# EAGLE board EEZ DIB DCP405 r1B1 (EAGLE 7.2.0), part 1 of 2
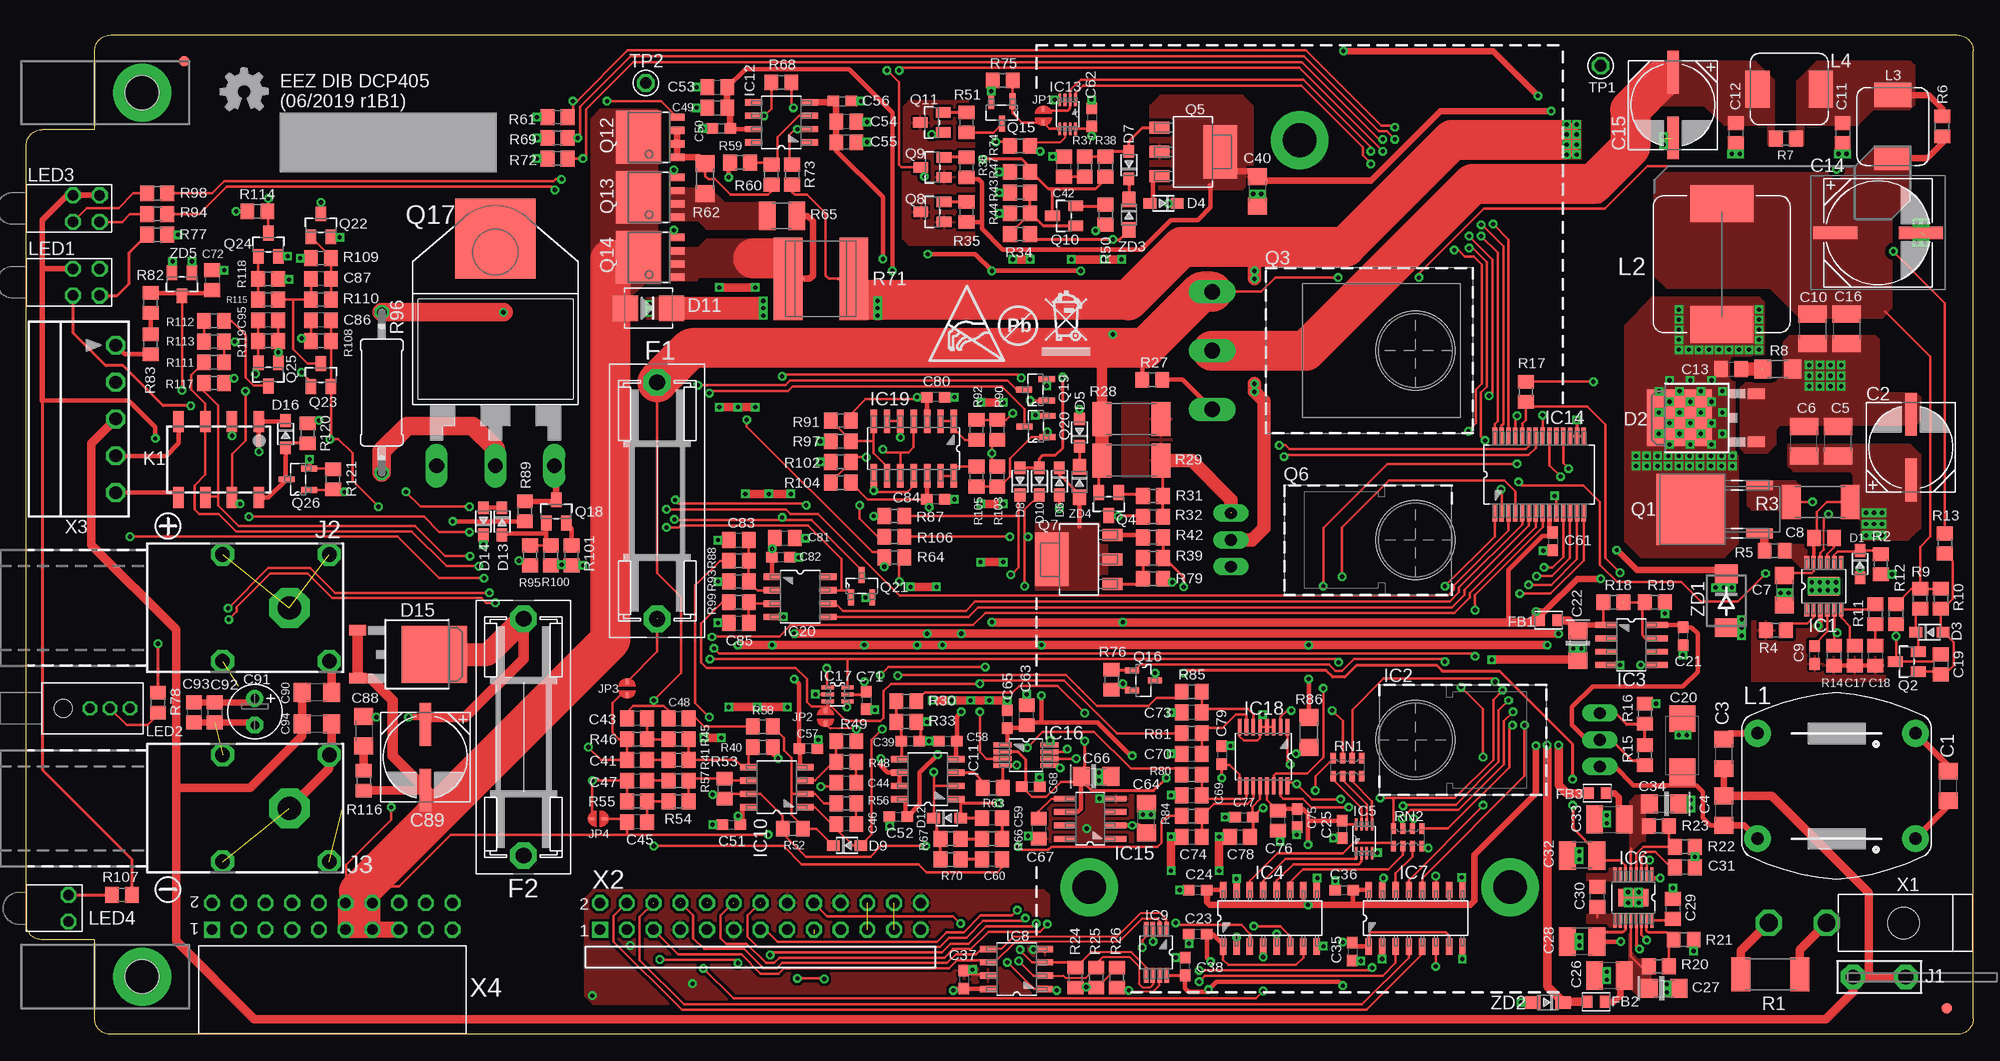
[diagram p6: board, top side]
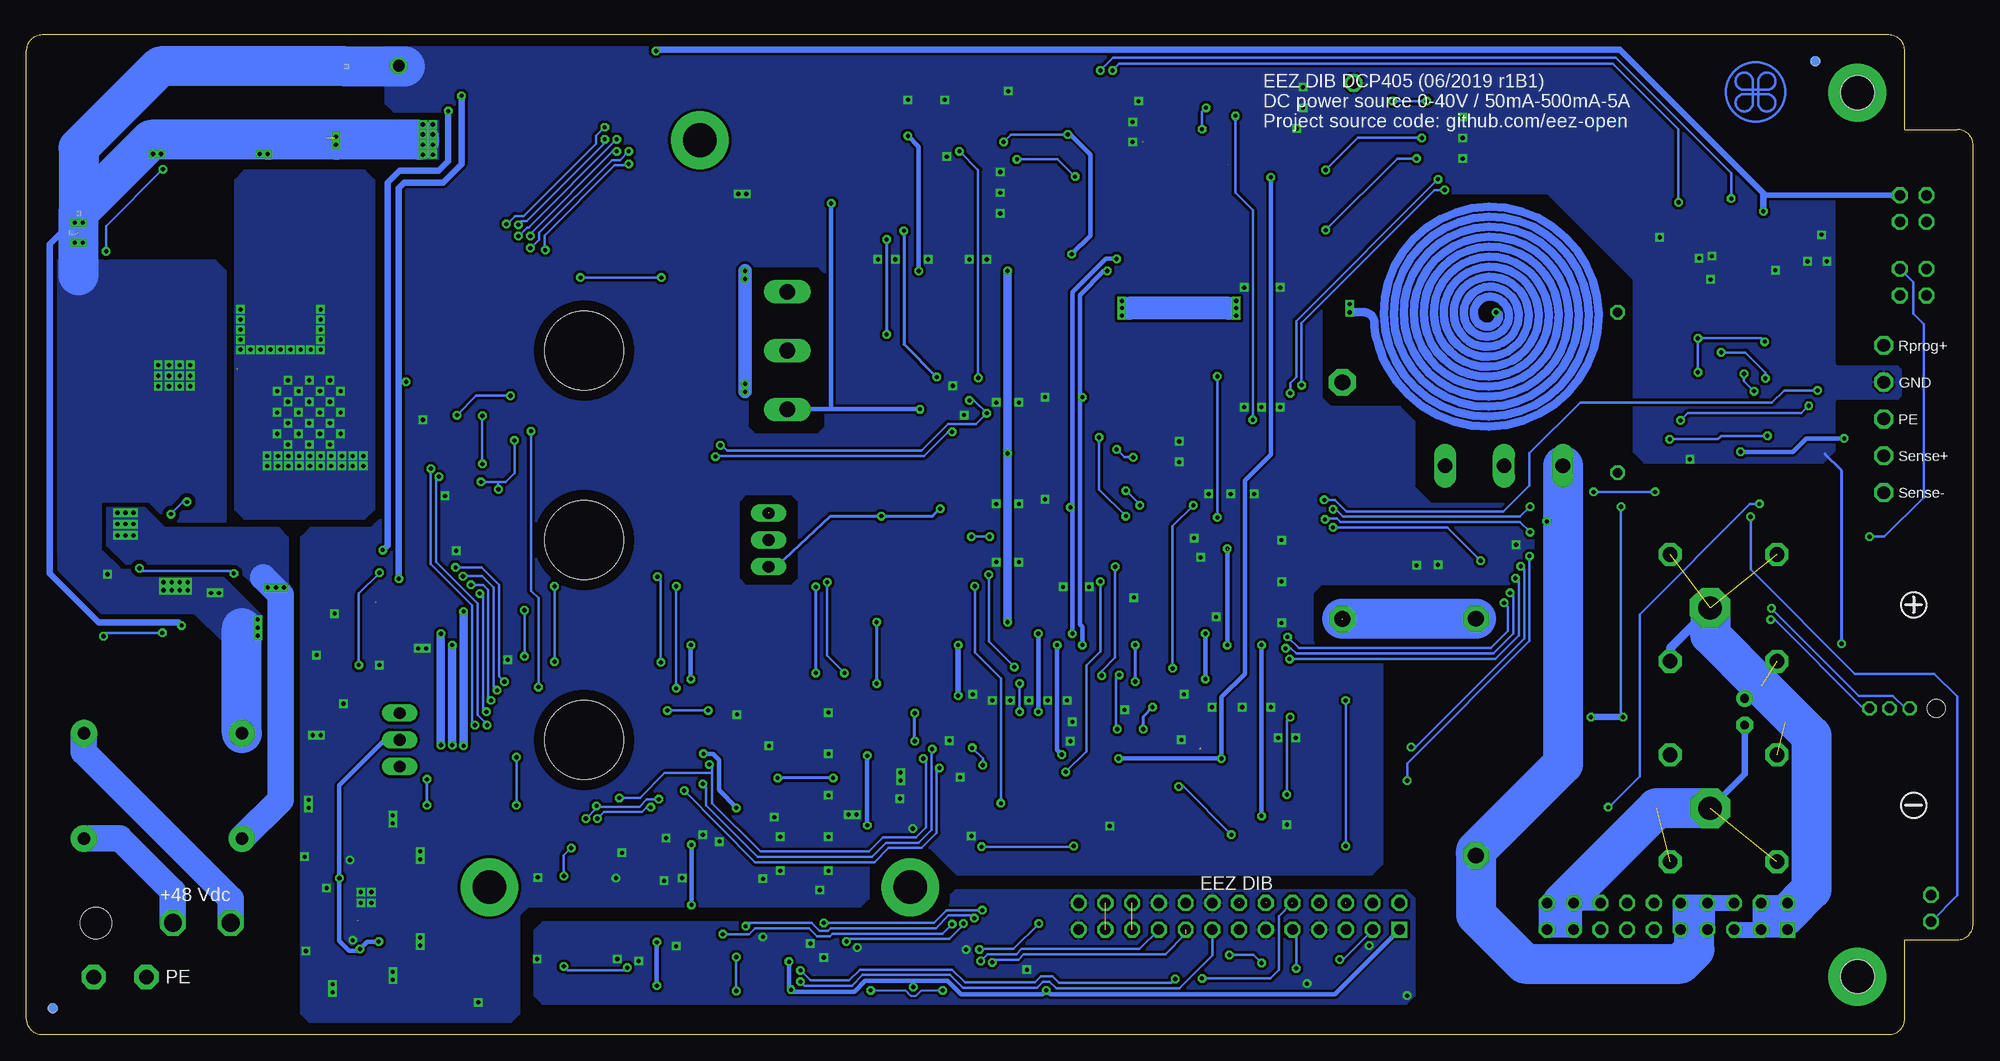
[diagram p7: board, bottom side, seen from below]

Size 185 x 95 mm. Coordinates in mm from the lower left corner, seen from the top.
Outline: 8,95 183.5,95 arc-90 185,93.5 185,1.5 arc-90 183.5,0 8,0 arc-90 6.5,1.5 6.5,9 1.5,9 arc-90 0,10.5 0,84.5 arc-90 1.5,86 6.5,86 6.5,93.5 arc-90 8,95
Copper layers (1*16): Top 0.035mm / dielectric 1.5mm / Bottom 0.035mm
Design rules "default *": minimum track width 6mil, minimum drill 0.3mm, track to track 6mil, track to pad 6mil, pad to pad 6mil, via to via 6mil, smd to smd 6mil, copper to edge 40mil, drill to drill 8mil, minimum pad ring 4mil, minimum via ring 8mil, stop-mask expansion 2.5mil, vias tented up to drill 1mm, thermal gap 8mil
Net classes: 0 default: width 0.203 mm, drill 0.3 mm, clearance 0.203 mm; 1 lvds: width 0.152 mm, drill 0.3 mm, clearance 0.152 mm to class 0, clearance 0.152 mm; 2 gnd: width 0.254 mm, drill 0.584 mm, clearance 0.254 mm
Holes 7.5 mm at 132,65 132,47 132,28
vRestrict: area 97.5,10.5 to 104.5,17.5; area 137.5,10.5 to 144.5,17.5; area 117.5,81.5 to 124.5,88.5

## Footprints (pad centres in the part's own frame; a part is rotated, then mirrored left to right if it is on the bottom)
C1206 = smd 1.6 x 1.8: 1 -1.4,0; 2 1.4,0
CAPAE830X1050N = smd 4.064 x 1.092: + -3.124,0; - 3.124,0
C1210 = smd 1.6 x 2.7: 1 -1.4,0; 2 1.4,0
C0805 = smd 1.3 x 1.5: 1 -0.95,0; 2 0.95,0
C0603 = smd 1.1 x 1: 1 -0.85,0; 2 0.85,0
CAPAE1030X1050N = smd 4.166 x 1.194: + -4.064,0; - 4.064,0
C/6032-28R = smd 2.55 x 2.5: + 2.525,0; - -2.525,0
EC1206 = smd 1.6 x 1.8: + -1.4,0; - 1.4,0
ECAP2/5 = drill 0.813 pad 1.6: + -1.27,0 | drill 0.813 pad 1.6 octagon: - 1.27,0
SOD323-R = smd 1.2 x 1: A 1.3,0; C -1.3,0
TO252-L = smd 1 x 1.6: 1 -2.28,-6.07; 2 2.28,-6.07 | smd 5.4 x 6.2: 3 0,1.23
SMB = smd 2.4 x 2.4: A 2.2,0; C -2.2,0
ZH32 = drill 1.5 pad 2.54 octagon: 1 -11.25,0; 2 11.25,0
BEAD0603 = smd 1 x 1.1: P$1 -0.85,0; P$2 0.85,0
FIDUCIAL_DUAL = smd 1.016 x 1.016 bottom: B 0,0 | smd 1.016 x 1.016: T 0,0
LTC_05-08-1666 = smd 1.27 x 0.457: 1 -2.235,1.63; 2 -2.235,0.98; 3 -2.235,0.33; 4 -2.235,-0.33; 5 -2.235,-0.98; 6 -2.235,-1.63; 7 2.235,-1.63; 8 2.235,-0.98; 9 2.235,-0.33; 10 2.235,0.33; 11 2.235,0.98; 12 2.235,1.63 | smd 1.753 x 2.946: TP 0,0
TO220H-CLR2 = drill 1.118 long: 1 -2.54,-17.526; 2 0,-17.526; 3 2.54,-17.526
SOIC127P600X175-8N = smd 1.981 x 0.559: 1 -2.464,1.905; 2 -2.464,0.635; 3 -2.464,-0.635; 4 -2.464,-1.905; 5 2.464,-1.905; 6 2.464,-0.635; 7 2.464,0.635; 8 2.464,1.905
SOIC-16 = smd 1.549 x 0.61: 1 -2.692,4.445; 2 -2.692,3.175; 3 -2.692,1.905; 4 -2.692,0.635; 5 -2.692,-0.635; 6 -2.692,-1.905; 7 -2.692,-3.175; 8 -2.692,-4.445; 9 2.692,-4.445; 10 2.692,-3.175; 11 2.692,-1.905; 12 2.692,-0.635; 13 2.692,0.635; 14 2.692,1.905; 15 2.692,3.175; 16 2.692,4.445
DCU8 = smd 1.168 x 0.254: 1 -1.372,0.75; 2 -1.372,0.25; 3 -1.372,-0.25; 4 -1.372,-0.75; 5 1.372,-0.75; 6 1.372,-0.25; 7 1.372,0.25; 8 1.372,0.75
SOP50P490X110-17N = smd 1.397 x 0.279: 1 -2.184,1.753; 2 -2.184,1.245; 3 -2.184,0.762; 4 -2.184,0.254; 5 -2.184,-0.254; 6 -2.184,-0.762; 7 -2.184,-1.245; 8 -2.184,-1.753; 9 2.184,-1.753; 10 2.184,-1.245; 11 2.184,-0.762; 12 2.184,-0.254; 13 2.184,0.254; 14 2.184,0.762; 15 2.184,1.245; 16 2.184,1.753 | smd 1.651 x 2.845: 17 0,0
SOIC127P600X173-8N = smd 1.55 x 0.6: 1 -2.7,1.9; 2 -2.7,0.63; 3 -2.7,-0.64; 4 -2.7,-1.91; 5 2.7,-1.91; 6 2.7,-0.64; 7 2.7,0.63; 8 2.7,1.9
DGK8 = smd 1.422 x 0.432: 1 -2.184,0.965; 2 -2.184,0.33; 3 -2.184,-0.33; 4 -2.184,-0.965; 5 2.184,-0.965; 6 2.184,-0.33; 7 2.184,0.33; 8 2.184,0.965
SOP65P780X200-28N = smd 1.651 x 0.432: 1 -3.632,4.216; 2 -3.632,3.581; 3 -3.632,2.921; 4 -3.632,2.286; 5 -3.632,1.626; 6 -3.632,0.965; 7 -3.632,0.33; 8 -3.632,-0.33; 9 -3.632,-0.965; 10 -3.632,-1.626; 11 -3.632,-2.286; 12 -3.632,-2.921; 13 -3.632,-3.581; 14 -3.632,-4.216; 15 3.632,-4.216; 16 3.632,-3.581; 17 3.632,-2.921; 18 3.632,-2.286; 19 3.632,-1.626; 20 3.632,-0.965; 21 3.632,-0.33; 22 3.632,0.33; 23 3.632,0.965; 24 3.632,1.626; 25 3.632,2.286; 26 3.632,2.921; 27 3.632,3.581; 28 3.632,4.216
DGK8-M = smd 1.727 x 0.483: 1 -2.235,0.965; 2 -2.235,0.33; 3 -2.235,-0.33; 4 -2.235,-0.965; 5 2.235,-0.965; 6 2.235,-0.33; 7 2.235,0.33; 8 2.235,0.965
SOT65P210X110-6N = smd 1.168 x 0.356: 1 -0.94,0.66; 2 -0.94,0; 3 -0.94,-0.66; 4 0.94,-0.66; 5 0.94,0; 6 0.94,0.66
PW(R-PDSO-G16) = smd 1.6 x 0.35: 1 -2.8,2.3; 2 -2.8,1.65; 3 -2.8,1; 4 -2.8,0.35; 5 -2.8,-0.3; 6 -2.8,-0.95; 7 -2.8,-1.6; 8 -2.8,-2.25; 9 2.8,-2.25; 10 2.8,-1.6; 11 2.8,-0.95; 12 2.8,-0.3; 13 2.8,0.35; 14 2.8,1; 15 2.8,1.65; 16 2.8,2.3
SOIC127P600X175-14N = smd 2.2 x 0.6: 1 -2.591,3.81; 2 -2.591,2.54; 3 -2.591,1.27; 4 -2.591,0; 5 -2.591,-1.27; 6 -2.591,-2.54; 7 -2.591,-3.81; 8 2.591,-3.81; 9 2.591,-2.54; 10 2.591,-1.27; 11 2.591,0; 12 2.591,1.27; 13 2.591,2.54; 14 2.591,3.81
PCB_TAB-4907 = drill 1.4 pad 2.3 octagon: 1 -2.5,0; 2 2.5,0
S16N-PC = drill 2.2 pad 3.81 octagon: 1 0,0 | drill 1.4 pad 2.184 octagon: NC1 -3.8,5.08; NC2 -3.8,-5.08; NC3 6.36,5.08; NC4 6.36,-5.08
JP2-CUT = smd 0.508 x 0.254: 1 -0.635,0; 2 0.635,0
G6K-2F = smd 1 x 2: 1 -3.81,-3.6; 2 -1.27,-3.6; 3 1.27,-3.6; 4 3.81,-3.6; 5 3.81,3.6; 6 1.27,3.6; 7 -1.27,3.6; 8 -3.81,3.6
PCB-MB = hole 3.2: 0,0
RN112 = drill 1.2 pad 2.54: 1 -7.5,5; 2 7.5,5; 3 -7.5,-5; 4 7.5,-5
125CDMCC/DS = smd 3.5 x 6: 1 -5.75,0; 2 5.75,0
COILCRAFT_HPI0630 = smd 2.3 x 3.5: 1 -3,0; 2 3,0
WP934MD = drill 1 octagon: BA -1.27,1.27; BC -1.27,-1.27; TA 1.27,1.27; TC 1.27,-1.27
L-42WUM-1EGWT = drill 0.9 octagon: CC 4.445,0; GREEN 6.35,0; RED 2.54,0 | hole 1.7: 0,0
WP934AD = drill 1 octagon: A 0,1.27; C 0,-1.27
TO229P990X239-3N = smd 0.94 x 2.489: 1 -2.286,-6.401; 3 2.286,-6.401 | smd 6.731 x 6.528: 2 0,0.152
SOT23-BEC = smd 1 x 1.4: B -0.95,-1.1; C 0,1.1; E 0.95,-1.1
TO247BH-CLR2 = drill 1.499 long: 1 -5.588,-19.304; 2 0,-19.304; 3 5.588,-19.304
SOT230P700X180-4N = smd 1.905 x 1.143: 1 -3.2,2.311; 2 -3.2,0; 3 -3.2,-2.311 | smd 3.175 x 5.08: 4 2.565,0
SOT669 = smd 0.7 x 1.4: 1 -1.905,-2.65; 2 -0.635,-2.65; 3 0.635,-2.65; 4 1.905,-2.65 | smd 5 x 4.3: MB 0,1
SOT103P240X110-3N = smd 1.524 x 0.559: 1 -1.079,1.016; 2 -1.079,-1.016; 3 1.079,0
SOT95P237X112-3N = smd 1.321 x 0.559: 1 -1.092,0.94; 2 -1.092,-0.94; 3 1.092,0
TOP3_TRIAC_NOHOLE = drill 1.397 long: A1 -5.588,-20.32; A2 0,-20.32; G 5.588,-20.32 | smd 7.62 x 7.62: NC 0,1.27
R2512 = smd 1.8 x 3.2: 1 -2.8,0; 2 2.8,0
R0805 = smd 1.3 x 1.5: 1 -0.95,0; 2 0.95,0
R1206 = smd 1.6 x 1.803: 1 -1.422,0; 2 1.422,0
R1210 = smd 1.6 x 2.7: 1 -1.4,0; 2 1.4,0
R_H2728 = smd 2.743 x 7.823: 1 -3.124,0; 2 3.124,0 | smd 0.508 x 0.254: 1S -1.841,0; 2S 1.841,0
0411/15 = drill 0.914 octagon: 1 -7.62,0; 2 7.62,0
CAY16 = smd 0.5 x 1: 1 -1.35,-0.85; 2 -0.45,-0.85; 3 0.45,-0.85; 4 1.35,-0.85; 5 1.35,0.85; 6 0.45,0.85; 7 -0.45,0.85; 8 -1.35,0.85
SHORT_NOHOLE = smd 0.5 x 0.25 bottom: 1 0,0.117; 2 0,-0.117
PCB_SHIELD_TAB = drill 1.1 octagon: 1 0,0
MINIFIT_39301020 = drill 1.7 octagon: 1 0,0; 2 0,5.5 | hole 3: 0,-7.3
M20-9701346 = drill 1 pad 1.5 square: 1 -30.48,-2.54 | drill 1 pad 1.5 octagon: 2 -30.48,0; 3 -27.94,-2.54; 4 -27.94,0; 5 -25.4,-2.54; 6 -25.4,0; 7 -22.86,-2.54; 8 -22.86,0; 9 -20.32,-2.54; 10 -20.32,0; 11 -17.78,-2.54; 12 -17.78,0; 13 -15.24,-2.54; 14 -15.24,0; 15 -12.7,-2.54; 16 -12.7,0; 17 -10.16,-2.54; 18 -10.16,0; 19 -7.62,-2.54; 20 -7.62,0; 21 -5.08,-2.54; 22 -5.08,0; 23 -2.54,-2.54; 24 -2.54,0; 25 0,-2.54; 26 0,0
MC1,5/5-G-3,5 = drill 1.2 octagon: 1 -7,0; 2 -3.5,0; 3 0,0; 4 3.5,0; 5 7,0
SSW-110-02-T-D-RA = drill 1 pad 1.5 square: 1 22.86,2.54 | drill 1 pad 1.5 octagon: 2 22.86,0; 3 20.32,2.54; 4 20.32,0; 5 17.78,2.54; 6 17.78,0; 7 15.24,2.54; 8 15.24,0; 9 12.7,2.54; 10 12.7,0; 11 10.16,2.54; 12 10.16,0; 13 7.62,2.54; 14 7.62,0; 15 5.08,2.54; 16 5.08,0; 17 2.54,2.54; 18 2.54,0; 19 0,2.54; 20 0,0
DO214AA = smd 1.8 x 2.2: A 2.55,0; C -2.55,0
SOD323-W = smd 1.5 x 1.2: A 1.45,0; C -1.45,0
SOT23 = smd 1 x 1.4: 1 -0.95,-1.1; 2 0.95,-1.1; 3 0,1.1

## Placement (x,y rotation side)
C1  4n7/100V  [C1206]  182.63,23.62 270 top
C2  HHXC630ARA220MHA0G  [CAPAE830X1050N]  179.07,55.82 90 top
C3  4n7/100V  [C1206]  161.29,26.67 270 top
C4  4n7/100V  [C1206]  161.29,21.27 270 top
C5  4u7/100V  [C1210]  172.15,56.39 90 top
C6  4u7/100V  [C1210]  168.91,56.39 90 top
C7  1u/100V  [C1206]  167.07,42.23 270 top
C8  470n  [C0805]  170.81,47.18 180 top
C9  100n  [C0603]  169.93,36.07 90 top
C10  10u  [C1210]  169.74,67.06 270 top
C11  1u  [C0805]  172.59,85.66 270 top
C12  n.c.  [C0805]  162.43,85.66 270 top
C13  470p  [C0805]  161.99,63.25 0 top
C14  EEEFK1J101P  [CAPAE1030X1050N]  175.96,76.2 0 top
C15  EEEFK1H470P  [CAPAE830X1050N]  156.46,88.33 270 top
C16  10u  [C1210]  172.97,67.06 270 top
C17  120p  [C0805]  173.74,36 270 top
C18  4n7  [C0805]  175.7,36 270 top
C19  470p  [C0805]  181.93,35.18 270 top
C20  1uF/50V Tant.  [C/6032-28R]  157.35,27.5 270 top
C21  100n  [C0603]  157.42,37.85 270 top
C22  4u7 tant.  [EC1206]  147.45,36.96 270 top
C23  100n  [C0603]  111.32,9.53 180 top
C24  100n  [C0603]  111.32,13.72 0 top
C25  100n  [C0603]  125.03,19.49 270 top
C26  10u  [C1210]  150.43,5.59 180 top
C27  10u tant.  [EC1206]  155.64,4.38 0 top
C28  10u  [C1210]  147.83,8.83 180 top
C29  10n  [C0805]  156.46,11.94 270 top
C30  1u  [C0805]  149.29,13.08 90 top
C31  10n  [C0805]  157.61,15.88 180 top
C32  10u  [C1210]  147.83,17.02 180 top
C33  10u  [C1210]  150.43,20.45 0 top
C34  10u tant.  [EC1206]  155.64,21.91 180 top
C35  100n  [C0603]  125.98,7.87 270 top
C36  100n  [C0603]  125.22,13.72 0 top
C37  100n  [C0603]  89.09,5.21 270 top
C38  100n  [C0603]  110.11,6.48 90 top
C39  100n  [C0603]  84.01,27.88 0 top
C40  1u/100V  [C1206]  116.97,80.14 270 top
C41  47p  [C0805]  58.04,26.1 0 top
C42  10n  [C0805]  98.62,82.49 90 top
C43  2n2  [C0805]  58.04,30.04 180 top
C44  2n2  [C0805]  77.91,23.94 0 top
C45  2n2  [C0805]  58.04,20.19 180 top
C46  220p  [C0805]  77.91,20 180 top
C47  47p  [C0805]  58.04,24.13 0 top
C48  2n2  [C0805]  61.98,30.04 0 top
C49  10n  [C0805]  65.66,88.07 0 top
C50  100n  [C0603]  66.04,86.11 180 top
C51  100n  [C0603]  66.99,19.94 0 top
C52  100n  [C0603]  82.87,20.7 0 top
C53  1u  [C0805]  65.66,90.04 0 top
C54  10n  [C0805]  77.91,86.74 180 top
C55  1u  [C0805]  77.91,84.79 180 top
C56  100n  [C0603]  77.53,88.71 0 top
C57  100n  [C0603]  74.3,27.18 180 top
C58  100n  [C0603]  87.57,27.88 0 top
C59  1n  [C0805]  91.76,20.57 180 top
C60  1n  [C0805]  91.76,16.64 180 top
C61  100n  [C0603]  145.03,46.86 270 top
C62  100n  [C0603]  101.24,87.15 270 top
C63  1u  [C0805]  95.06,30.35 90 top
C64  4u7  [C1206]  106.43,20.57 90 top
C65  100n  [C0603]  93.22,29.97 270 top
C66  4u7 tant.  [EC1206]  101.66,24.51 0 top
C67  1u  [C0805]  96.2,19.56 270 top
C68  100n  [C0603]  95.44,23.56 180 top
C69  3n3  [C0805]  110.74,22.73 0 top
C70  3n3  [C0805]  110.74,26.67 0 top
C71  100n  [C0603]  79.82,31.75 270 top
C72  10n  [C0805]  17.65,71.69 270 top
C73  3n3  [C0805]  110.74,30.61 180 top
C74  3n3  [C0805]  110.74,18.8 0 top
C75  100n  [C0603]  120.78,20.57 90 top
C76  1u  [C0805]  118.94,20.32 90 top
C77  100n  [C0603]  115.7,20.64 0 top
C78  1u  [C0805]  115.32,18.8 0 top
C79  100n  [C0603]  113.6,26.54 270 top
C80  100n  [C0603]  86.42,60.58 180 top
C81  1u  [C0805]  72.07,47.18 0 top
C82  100n  [C0603]  71.69,45.34 180 top
C83  1n  [C0805]  67.69,46.99 0 top
C84  100n  [C0603]  86.42,50.86 180 top
C85  1n  [C0805]  67.69,39.12 0 top
C86  10n  [C0805]  28,67.88 180 top
C87  2n2  [C0805]  28,71.82 180 top
C88  470n  [C1206]  32.07,28.83 270 top
C89  HHXC630ARA220MHA0G  [CAPAE830X1050N]  37.91,26.35 270 top
C90  10n/200V  [C1206]  27.62,32.51 180 top
C91  N.C.  [ECAP2/5]  21.72,30.67 270 top
C92  N.C.  [C0805]  17.91,30.61 270 top
C93  N.C.  [C0805]  15.94,30.61 270 top
C94  10n/200V  [C1206]  27.62,29.53 0 top
C95  10n  [C0805]  22.99,67.88 180 top
D1  BAS316  [SOD323-R]  174.24,44.7 270 top
D2  STPS15H100  [TO252-L]  158.31,58.61 90 top
D3  BAS316  [SOD323-R]  180.85,38.23 0 top
D4  BAS316  [SOD323-R]  108.08,78.99 180 top
D5  BAS316  [SOD323-R]  100.08,57.21 90 top
D6  BAS316  [SOD323-R]  98.17,52.58 270 top
D7  BAS316  [SOD323-R]  104.78,82.61 90 top
D8  BAS316  [SOD323-R]  94.42,52.58 90 top
D9  BAS316  [SOD323-R]  77.98,17.97 0 top
D10  BAS316  [SOD323-R]  96.27,52.58 90 top
D11  SK55  [SMB]  59.12,69.02 180 top
D12  BAS316  [SOD323-R]  87.5,20.57 0 top
D13  BAS316  [SOD323-R]  45.21,48.77 270 top
D14  BAS316  [SOD323-R]  43.43,48.77 90 top
D15  SK10100D1-DIO  [TO252-L]  37.56,36.13 270 top
D16  BAS316  [SOD323-R]  24.64,57.05 270 top
EEZ_SIGNATURE  SIGNATURESMALL  [SIGNATURE_5MM]  20.68,89.58 180 top
F1  ZH32  [ZH32]  59.94,50.74 270 top
F2  ZH32  [ZH32]  47.24,28.26 270 top
FB1  60R@100MHz  [BEAD0603]  144.65,39.37 180 top
FB2  60R@100MHz  [BEAD0603]  149.16,3.11 180 top
FB3  60R@100MHz  [BEAD0603]  149.29,22.92 180 top
FM1  FIDUCIAL_2  [FIDUCIAL_DUAL]  15,92.5 0 top
FM2  FIDUCIAL_2  [FIDUCIAL_DUAL]  182.5,2.5 0 top
IC1  LTC3864EMSE#PBF  [LTC_05-08-1666]  170.81,42.61 90 top
IC2  TL783CKCSE3  [TO220H-CLR2]  132,28 270 bottom
IC3  LP2951  [SOIC127P600X175-8N]  152.53,37.02 0 top
IC4  SI8641BB-B-IS1  [SOIC-16]  118.17,11.05 90 top
IC5  SN74LVC1G139DCUR  [DCU8]  127.13,18.61 90 top
IC6  LTC3260EMSE#PBF  [SOP50P490X110-17N]  152.72,13.02 270 top
IC7  SI8641BB-B-IS1  [SOIC-16]  132.02,11.05 90 top
IC8  M24C32-WMN6P  [SOIC127P600X173-8N]  94.11,6.22 180 top
IC9  TMP1075AIDGK  [DGK8]  107.38,7.81 270 top
IC10  OPA2196ID  [SOIC127P600X173-8N]  71.31,23.5 180 top
IC11  MC33272ADR2G  [SOIC127P600X173-8N]  85.66,24.26 180 top
IC12  LTC2050HVCS8#PBF  [SOIC127P600X173-8N]  71.75,86.68 180 top
IC13  74AUP1G74DC.125  [DCU8]  98.95,87.45 270 top
IC14  MCP23S17-E/SS  [SOP65P780X200-28N]  143.76,53.21 90 top
IC15  REF5025AIDR  [SOIC127P600X175-8N]  101.09,20.51 180 top
IC16  DAC8552IDGKR  [DGK8-M]  95,26.54 0 top
IC17  SN74LVC1G3157DCKR  [SOT65P210X110-6N]  77.09,32.32 0 top
IC18  ADS1120IPWR  [PW(R-PDSO-G16)]  117.54,26.42 270 top
IC19  LM339D  [SOIC127P600X175-14N]  84.33,55.69 270 top
IC20  MAX9141ESA  [SOIC127P600X173-8N]  73.53,41.59 0 top
J1  4907  [PCB_TAB-4907]  176.09,5.46 180 top
J2  FCR7350R  [S16N-PC]  25,40.55 180 top
J3  FCR7350B  [S16N-PC]  25,21.5 180 top
JP1  JP2-CUT  [JP2-CUT]  96.65,87.31 270 top
JP2  JP2-CUT  [JP2-CUT]  75.95,30.16 270 top
JP3  JP2-CUT  [JP2-CUT]  57.09,32.89 90 top
JP4  JP2-CUT  [JP2-CUT]  54.36,20.51 180 top
K1  G6K-2F-5DC  [G6K-2F]  18.29,54.64 180 top
KK1  PCB-MB-01  [PCB-MB]  11,89.5 0 top
KK2  PCB-MB-01  [PCB-MB]  11,5.5 0 top
L1  RN112-4-02-0M7  [RN112]  172.02,23.62 180 top
L2  125CDMCCDS-330MC  [125CDMCC/DS]  161.1,73.22 90 top
L3  VLS6045AF-3R3N  [COILCRAFT_HPI0630]  177.36,86.3 90 top
L4  VLS6045AF-3R3N  [COILCRAFT_HPI0630]  167.51,89.85 180 top
LED1  WP934MD/2LID  [WP934MD]  5.7,71.5 0 top
LED2  WP42WUM/EGW  [L-42WUM-1EGWT]  3.5,31 0 top
LED3  WP934MD/LYLID  [WP934MD]  5.7,78.5 0 top
LED4  WP934AD/YD  [WP934AD]  4,12 0 top
Q1  SUD19P06-60  [TO229P990X239-3N]  158.31,49.91 90 top
Q2  MMBT5401  [SOT23-BEC]  178.69,35.43 90 top
Q3  IRFP250MPBF  [TO247BH-CLR2]  132,65 90 bottom
Q4  BC856C  [SOT23-BEC]  102.87,50.42 180 top
Q5  BCP56-16.115  [SOT230P700X180-4N]  110.87,83.88 0 top
Q6  STF10P6F6  [TO220H-CLR2]  132,47 90 bottom
Q7  BCP56-16.115  [SOT230P700X180-4N]  100.01,45.15 180 top
Q8  MMBT5401  [SOT23-BEC]  86.11,78.17 90 top
Q9  MMBT5401  [SOT23-BEC]  86.11,82.42 90 top
Q10  MMBT5551  [SOT23-BEC]  98.62,77.79 90 top
Q11  MMBT5551  [SOT23-BEC]  86.04,86.68 90 top
Q12  PSMN0R9-25YLC  [SOT669]  59.18,85.28 90 top
Q13  PSMN0R9-25YLC  [SOT669]  59.18,79.57 90 top
Q14  PSMN0R9-25YLC  [SOT669]  59.18,73.85 90 top
Q15  2N7002  [SOT103P240X110-3N]  92.71,87.63 270 top
Q16  BSS84P  [SOT95P237X112-3N]  106.17,33.66 0 top
Q17  BTA26-600  [TOP3_TRIAC_NOHOLE]  44.58,74.36 0 top
Q18  FMMT493TA  [SOT23-BEC]  50.36,49.72 0 top
Q19  2N7002  [SOT103P240X110-3N]  95.89,61.28 180 top
Q20  2N7002  [SOT103P240X110-3N]  95.95,57.78 180 top
Q21  2N7002  [SOT103P240X110-3N]  79.38,42.61 90 top
Q22  MMBT5551  [SOT23-BEC]  28,76.9 0 top
Q23  MMBT5401  [SOT23-BEC]  28,62.67 0 top
Q24  MMBT5551  [SOT23-BEC]  22.99,75.06 0 top
Q25  MMBT5551  [SOT23-BEC]  22.99,62.74 180 top
Q26  2N7002  [SOT103P240X110-3N]  25.81,52.77 180 top
R1  4K7/2W  [R2512]  165.74,5.71 0 top
R2  10K  [R0805]  176.21,44.7 90 top
R3  R010/2W  [R2512]  170.5,50.61 180 top
R4  47K  [R0805]  166.24,38.42 180 top
R5  1R  [R0805]  166.12,45.97 180 top
R6  100R  [R0805]  182.05,86.3 90 top
R7  100R  [R0805]  167.2,85.15 180 top
R8  10R  [R1206]  166.43,63.25 180 top
R9  10K  [R0805]  179.96,41.4 270 top
R10  100K  [R0805]  181.93,41.4 270 top
R11  10K  [R0805]  175.7,39.94 90 top
R12  316K  [R0805]  177.67,39.94 270 top
R13  100K  [R0805]  182.31,46.67 90 top
R14  4K7  [R0805]  171.77,36 270 top
R15  220R  [R0805]  153.8,26.54 90 top
R16  1K8  [R0805]  153.8,30.48 90 top
R17  10K  [R0805]  142.49,61.09 270 top
R18  16K  [R0805]  150.81,41.08 0 top
R19  5K1  [R0805]  154.75,41.08 0 top
R20  316K  [R0805]  155.13,6.48 0 top
R21  100K  [R0805]  157.48,9.02 0 top
R22  100K  [R0805]  157.61,17.84 180 top
R23  316K  [R0805]  155.13,19.81 180 top
R24  10K  [R0805]  99.69,5.4 90 top
R25  10K  [R0805]  101.66,5.4 90 top
R26  10K  [R0805]  103.63,5.4 270 top
R27  1K  [R0805]  107,62.23 180 top
R28  3R9/2W  [R2512]  105.03,58.49 180 top
R29  3R9/2W  [R2512]  105.03,54.55 180 top
R30  10K  [R0805]  83.63,31.69 180 top
R31  2K2  [R0805]  107.06,51.18 180 top
R32  2K2  [R0805]  107.06,49.21 180 top
R33  220R  [R0805]  83.63,29.72 0 top
R34  16K  [R0805]  94.42,76.07 0 top
R35  220R  [R0805]  89.34,78.17 270 top
R36  220R  [R0805]  89.34,82.42 270 top
R37  470R  [R0805]  100.58,82.49 90 top
R38  100R  [R0805]  102.55,82.49 270 top
R39  1K  [R0805]  107.06,45.28 0 top
R40  7K5 0.1%  [R0805]  69.98,27.3 180 top
R41  10K  [R0805]  61.98,26.1 0 top
R42  220R  [R0805]  107.06,47.24 0 top
R43  2K2  [R0805]  94.42,80.01 0 top
R44  750R  [R0805]  94.42,78.04 0 top
R45  100K 0.1%  [R0805]  61.98,28.07 180 top
R46  24K 0.1%  [R0805]  58.04,28.07 180 top
R47  51K  [R0805]  94.42,81.98 0 top
R48  220R  [R0805]  77.91,25.91 180 top
R49  10K  [R0805]  77.91,27.88 180 top
R50  470R  [R0805]  102.55,77.91 90 top
R51  1K8  [R0805]  89.34,86.68 90 top
R52  10K  [R0805]  72.83,19.56 0 top
R53  7K5 0.1%  [R0805]  66.36,23.37 90 top
R54  100K 0.1%  [R0805]  61.98,22.16 180 top
R55  24K 0.1%  [R0805]  58.04,22.16 180 top
R56  0R  [R0805]  77.91,21.97 0 top
R57  10K  [R0805]  61.98,24.13 0 top
R58  220R  [R0805]  69.98,29.27 0 top
R59  3K9 0.1%  [R0805]  67.82,82.87 0 top
R60  82R 0.1%  [R0805]  70.8,81.72 90 top
R61  47K  [R0805]  50.48,87.19 0 top
R62  0R75  [R1206]  64.52,81.34 270 top
R63  2K2  [R0805]  91.82,23.43 180 top
R64  10K  [R0805]  82.49,45.34 0 top
R65  0R082  [R1210]  71.82,77.79 180 top
R66  1K  [R0805]  91.76,18.61 180 top
R67  10K  [R0805]  87.82,18.61 180 top
R68  3K9 0.1%  [R0805]  71.75,90.49 180 top
R69  47K  [R0805]  50.48,85.22 0 top
R70  10K  [R0805]  87.82,16.64 180 top
R71  0R010 (low TCR)  [R_H2728]  75.5,71.82 180 top
R72  47K  [R0805]  50.48,83.25 0 top
R73  82R 0.1%  [R0805]  72.77,81.72 90 top
R74  10K  [R0805]  94.42,84.45 0 top
R75  100K  [R0805]  92.77,90.68 0 top
R76  100K  [R0805]  103.12,33.72 90 top
R77  470R  [R0805]  12.45,76.01 180 top
R78  270R  [R0805]  12.51,31.53 90 top
R79  10K  [R0805]  107.06,43.31 0 top
R80  220R  [R0805]  110.74,24.7 0 top
R81  220R  [R0805]  110.74,28.64 0 top
R82  470R  [R0805]  11.81,69.53 270 top
R83  470R  [R0805]  11.81,65.6 270 top
R84  220R  [R0805]  110.74,20.76 0 top
R85  220R  [R0805]  110.74,32.58 0 top
R86  10R  [R1206]  121.86,28.7 270 top
R87  10K  [R0805]  82.49,49.28 180 top
R88  750R  [R0805]  67.69,45.02 0 top
R89  470R  [R0805]  47.37,49.72 270 top
R90  5K1  [R0805]  92.27,57.47 270 top
R91  47K  [R0805]  77.41,58.36 0 top
R92  5K6  [R0805]  90.3,57.47 90 top
R93  10K  [R0805]  67.69,43.05 180 top
R94  330R  [R0805]  12.45,77.98 0 top
R95  1K  [R0805]  47.88,45.53 270 top
R96  AC01000001007JA100  [0411/15]  33.78,61.02 270 top
R97  2K2  [R0805]  77.41,56.39 0 top
R98  330R  [R0805]  12.45,79.95 180 top
R99  10K  [R0805]  67.69,41.08 0 top
R100  100K  [R0805]  49.85,45.53 90 top
R101  6R2  [R0805]  51.82,45.53 90 top
R102  10K  [R0805]  77.41,54.42 180 top
R103  5K1  [R0805]  92.27,53.02 90 top
R104  10K  [R0805]  77.41,52.45 180 top
R105  5K6  [R0805]  90.3,53.02 270 top
R106  10K  [R0805]  82.49,47.31 180 top
R107  470R  [R0805]  9.08,13.27 180 top
R108  330R  [R0805]  28,65.91 0 top
R109  47K  [R0805]  28,73.79 0 top
R110  47K  [R0805]  28,69.85 0 top
R111  750R  [R0805]  17.84,63.88 0 top
R112  1K  [R0805]  17.84,67.82 180 top
R113  2K2  [R0805]  17.84,65.85 0 top
R114  10K  [R0805]  21.97,78.23 180 top
R115  10K  [R0805]  22.99,69.85 0 top
R116  1R  [R0805]  32.07,24.13 90 top
R117  750R  [R0805]  17.84,61.91 180 top
R118  47K  [R0805]  22.99,71.82 180 top
R119  330R  [R0805]  22.99,65.91 0 top
R120  470R  [R0805]  26.73,57.15 90 top
R121  100K  [R0805]  29.15,52.77 270 top
RN1  DR1206-33R-4/8  [CAY16]  125.54,25.4 0 top
RN2  DR1206-33R-4/8  [CAY16]  131.25,18.73 0 top
SH1  [SHORT_NOHOLE]  154.56,92.01 270 top
SH2  Pgnd to Pout- short  [SHORT_NOHOLE]  180.02,78.04 0 top
SH3  Sgnd to Pgnd short  [SHORT_NOHOLE]  180.72,76.2 270 top
TP1  [PCB_SHIELD_TAB]  149.61,92.08 0 top
TP2  [PCB_SHIELD_TAB]  58.86,90.42 0 top
U$1  [RECYCLE_BIN1/8]  96.52,64.52 0 top
U$6  [ESD_SYMBOL]  85.81,64.03 0 top
U$7  [PB_SMALL]  94.24,67.37 0 top
X1  39-30-1020  [MINIFIT_39301020]  171.07,10.6 90 top
X2  M20-9701346  [M20-9701346]  85,12.5 0 top
X3  1844249  [MC1,5/5-G-3,5]  8.5,58.5 270 top
X4  ZL263-20DG  [SSW-110-02-T-D-RA]  40.5,12.5 180 top
ZD1  SMAJ51A  [DO214AA]  161.54,41.21 270 top
ZD2  PDZ5.6B  [SOD323-W]  144.59,3.05 180 top
ZD3  BZX384-C13  [SOD323-W]  104.78,77.91 270 top
ZD4  PDZ6.2B  [SOD323-W]  100.08,52.51 270 top
ZD5  SLVU2.8-TP  [SOT23]  14.8,71.31 180 top

## Tracks (layer width: path | path; a pad name or v marks a point on that pad's centre or on a via)
5A_S
  Top 0.254: 71.82,73.79 71.82,72.38 R71.2
  Top 3.81: 69.07,73.79 71.82,73.79
  pour Top (isolate 0.305, no thermals): 61.21,71.69 63.69,71.69 64.01,72.01 69.72,72.01 69.72,75.56 64.64,75.56 63.82,74.74 61.21,74.74
50MA_S
  Top 0.254: R60.1 70.8,80.14 70.48,79.82 66.93,79.82 65.47,81.28 64.83,81.28 64.52,81.6 R62.1
  Top 0.61: Q12.3 Q12.2 Q12.1 63.91,83.38 R62.1
500MA_S
  Top 1.27: 70.36,77.85 R65.2
  pour Top (isolate 0.305, no thermals): 61.21,80.39 64.96,80.39 66.36,78.99 70.36,78.99 70.36,76.58 64.64,76.58 63.82,77.41 61.21,77.41
!ADC_DRDY  (via drill 0.4)
  Top 0.254: IC14.25 141.48,58.61 v141.67,58.8 | IC18.14 118.54,24.62 118.75,24.83 121.73,24.83 123.25,26.35 v123.25,32.89 | v123.25,42.61 123.25,48.13 129.35,54.23 v141.67,54.23
  Bottom 0.254: v141.67,58.8 v141.67,54.23 | v123.25,32.89 v123.25,42.61
!DP_DRIVE
  Top 0.305: 105.66,44.83 R39.1 R79.1 105.64,42.84 Q7.1
  Top 0.406: 105.75,43.22 R79.1
!OVP_FAULT  (via drill 0.4)
  Top 0.203: IC13.6 98.7,85.23 98.23,84.77 95.69,84.77 R74.2
  Top 0.254: Q21.3 79.38,44.13 74.61,48.9 72.07,48.9 v71.82,49.15 71.56,48.9 61.66,48.9 v61.59,48.96 | v71.82,62.55 71.88,62.55 72.07,62.74 94.23,62.74 v94.55,62.42 | v21.14,49.21 37.78,49.21 39.24,47.75 v42.1,47.75 | v96.33,83.95 95.88,83.95 R74.2
  Bottom 0.254: v61.59,48.96 61.53,49.02 60.45,49.02 60.13,48.7 43.05,48.7 v42.1,47.75 | v71.82,49.15 v71.82,62.55 | v94.55,62.42 94.55,82.17 v96.33,83.95 | v21.14,49.21 21.14,44.2 11.24,34.29 3.68,34.29 1.52,32.13 1.52,13.21 LED4.C
!OVP_LE
  Top 0.254: IC20.5 89.53,39.68 90.42,40.58 135.45,40.58 136.65,41.78 136.65,42.23 142.8,48.37 IC14.6
!RESET  (via drill 0.4)
  Top 0.254: IC14.18 146.05,54.29 v146.56,53.78 | IC7.12 132.65,14.86 142.37,24.57 v142.37,29.4
  Bottom 0.254: v146.56,53.78 146.56,44.7 142.62,40.77 142.62,29.65 v142.37,29.4 142.56,29.59
!SET_DP  (via drill 0.4)
  Top 0.254: IC14.1 139.55,47.35 v134.81,42.61 | 103.3,34.85 R76.2 | Q16.1 105.52,34.85 105.86,35.18 123.76,35.18 124.4,34.54 125.03,34.54 126.17,35.69 134.56,35.69 v134.81,35.43
  Top 0.305: Q16.1 103.2,34.59 R76.2
  Bottom 0.254: v134.81,42.61 v134.81,35.43
+3V3  (via drill 0.4)  (1 unrouted)
  Top 0.203: R25.1 101.73,4.45 R26.1
  Top 0.254: IC7.7 135.19,9.4 134.87,9.72 127.83,9.72 127.57,9.46 IC7.1 | 113.73,8.89 IC4.1 113.73,7.11 114.24,6.6 120.65,6.6 121.35,7.3 IC4.7 | R24.1 100.52,4.45 v100.71,4.51 100.9,4.45 R25.1
  Top 0.305: IC9.8 C38.1
  Top 0.406: IC7.1 126.03,8.36 C35.1 v125.09,8.76 | C37.2 89.13,4.6 | IC8.8 89.44,4.32 C37.2 | C23.1 112.33,9.53 | 113.73,8.89 113.67,8.83 113.47,8.83 112.78,9.53 C23.1 | C37.2 88.24,4.36 v88.08,4.19 | 112.2,9.36 C23.1 | v125.09,4.64 124.71,5.02 113.09,5.02 v112.33,4.25 112.14,4.06 110.43,4.06 110.11,4.38 C38.1 | C23.1 112.17,7.28 v112.52,6.92
  Bottom 0.254: v100.71,4.51 100.71,5.08
  Bottom 0.406: v125.09,4.64 v125.09,8.76 | v112.52,6.92 112.52,4.45 v112.33,4.25 112.14,4.06 106.3,4.06 105.28,5.08 100.71,5.08 97.47,5.08 96.2,3.81 88.46,3.81 v88.08,4.19 87.69,3.81 60.67,3.81 X2.1
+5V  (via drill 0.4)
  Top 0.254: C62.2 100.96,86.08 IC13.8 IC13.7 | IC7.10 135.19,12.38 135.25,12.32 | IC4.10 121.35,12.38 v121.79,12.32 | IC18.13 117.89,22.32 C76.2 | IC5.8 125.4,19.98 C25.1 | R90.2 91.76,56.01 v91.76,55.24 91.76,54.48 R103.2 | R17.1 146.3,62.04 v148.91,62.04 | v92.14,84.84 93.09,84.84 R74.1 | R114.2 v19.94,78.23
  Top 0.305: R114.2 21.02,77.85 | 1.52,60.26 1.52,25.15 10.03,16.64 R107.1 | 101.22,86.27 v101.22,85.41 | 103.25,32.64 R76.1 103.33,32.97 104.14,32.97 | v104.2,33.34 104.2,33.03 104.14,32.97 | 104.14,32.97 104.83,32.97 Q16.2
  Top 0.406: D16.C 24.52,58.24 K1.1 v22.1,55.37 | v12.26,56.64 12.26,57.72 9.72,60.26 1.52,60.26 | IC7.16 126.1,13.74 C36.2 126.07,12.41 125.98,12.32 | IC4.16 112.19,13.74 C24.2 | 101.25,86.36 C62.2 101.22,86.27 | C76.2 119.09,21.42 C75.2 121.32,21.42 121.79,20.95 121.79,20.32 | IC14.9 144.73,47.66 C61.1 144.69,47.37 144.08,47.37 140.84,44.13 140.84,39.24 140.91,39.18 | v100.2,72.58 v91.76,72.58 90.17,74.17 v85.66,74.17 | Q11.B 86.95,85.53 v86.04,85.53 | v121.79,18.03 121.79,20.32 | C25.1 125.01,20.32 121.79,20.32
  Top 0.508: 1.52,72.71 1.52,60.26 | 1.52,72.71 1.52,77.41 3.89,79.77 LED3.BA LED3.TA | LED1.BA 1.59,72.77 1.52,72.71
  Top 0.61: C24.2 112.17,12.61 112.46,12.32 v121.79,12.32 125.98,12.32 135.25,12.32 137.22,12.32 137.6,12.7 137.6,17.08 143.45,22.92 v143.45,27.43 | v149.61,43.31 147.38,43.31 144.27,40.2 v143.45,40.2 | v125.16,93.47 139.38,93.47 v143.64,89.22
  Top 0.813: v143.45,40.2 143.45,39.73 FB1.P$2 143.61,39.18 140.91,39.18 v104.2,39.18 v91.76,39.18
  Bottom 0.254: v148.91,62.04 149.61,62.04 | v86.04,85.53 91.44,85.53 v92.14,84.84
  Bottom 0.305: v104.2,39.18 v104.2,33.34
  Bottom 0.406: v22.1,55.37 17.14,55.37 15.88,56.64 v12.26,56.64 | v86.04,85.53 85.79,85.53 83.88,83.63 83.88,75.95 v85.66,74.17 | v121.79,18.03 v121.79,12.32 | v100.2,72.58 100.2,84.39 v101.22,85.41
  Bottom 0.508: LED3.TA 19.76,79.77 19.94,79.95
  Bottom 0.61: v143.64,89.22 143.64,82.74 145.41,80.96 149.1,80.96 149.61,80.45 149.61,62.04 v149.61,43.31 | v125.16,93.47 125.03,93.6 33.59,93.6 19.94,79.95 v19.94,78.23
  Bottom 0.813: v91.76,39.18 v91.76,55.24 v91.76,72.58 | v143.45,40.2 v143.45,27.43
+5VOUT
  Top 0.254: R20.1 153.42,6.48 152.46,7.43 IC6.12
  Top 0.61: FB2.P$1 150.88,3.11 151.45,3.68 151.45,5.2 C26.1
  pour Top (isolate 0.305, no thermals): 154.31,3.62 154.31,7.11 153.16,7.11 152.59,7.68 152.59,11.37 152.34,11.37 152.34,4.51 153.23,3.62
+VNR  (via drill 0.4)
  Top 0.254: IC6.1 154.47,14.88 154.5,14.86 154.56,14.86 | 149.22,9.78 C28.1
  Top 0.305: IC6.11 151.96,9.97 151.7,9.72 149.29,9.72 149.22,9.78 | IC6.13 152.97,8.45 v153.29,8.13 | IC2.2 150.62,28 152.58,26.04 153.35,26.04 R15.1
  Top 0.406: v151.51,8.83 C28.1 | v155.26,14.86 154.56,14.86 | IC3.8 157.19,38.92 C21.1 158.22,38.7 158.81,38.1 158.81,34.48 157.42,33.08 148.84,33.08 146.88,31.11 146.88,29.4 148.28,28 IC2.2
  Top 0.61: C21.1 157.58,38.44
  Bottom 0.406: v151.51,8.83 152.59,8.83 v153.29,8.13 153.48,7.94 154.31,7.94 155.26,8.89 v155.26,14.86 155.26,23.69 150.94,28 IC2.2
+VREF  (via drill 0.4)
  Top 0.254: IC18.9 115.25,23.65 115.25,24.7 114.33,25.63 113.67,25.63 C79.2 113.51,26.1 | C68.2 95.54,22.61 96.9,22.61 98.3,24 100.39,24 | v100.58,30.54 97.98,33.15 94.36,33.15 93.73,32.51 85.41,32.51 R30.1
  Top 0.305: 100.14,24.7 100.39,24.45 100.39,24.19 100.39,24 101.22,23.18 107.12,23.18 v108.33,24.38 | v113.6,24.38 C79.2 | 94.74,23.56 C68.2 94.93,23.9 94.93,26.16 94.23,26.86 92.77,26.86 IC16.2 | C66.+ 100.39,24.51 100.58,24.7 v100.58,27.88
  Top 0.406: 100.39,24.19 C66.+ 100.2,24.45 100.2,21.46 99.89,21.14 IC15.6
  Bottom 0.305: v108.33,24.38 v113.6,24.38 | v100.58,27.88 v100.58,30.54
-5VOUT
  Top 0.254: IC6.5 152.46,17.59 152.53,17.65
  Top 0.61: FB3.P$1 150.94,22.92 151.32,22.54 151.32,20.96 C33.2
  pour Top (isolate 0.305, no thermals): 152.53,14.61 152.4,14.61 152.4,22.16 152.91,22.67 153.8,22.67 153.8,18.1 152.53,16.83
-12V  (via drill 0.4)
  Top 0.254: IC6.6 151.96,16.07 151.45,16.57 149.67,16.57 C32.1
  Top 0.305: R42.2 R39.2 108.14,45.28 109.98,43.43 v109.98,42.55 | C32.1 149.23,17.33 146.94,19.62 v146.94,21.78 | v146.94,24.26 146.94,27.56 139.95,34.54 134.56,34.54 133.99,35.12 126.43,35.12 125.28,33.97 124.14,33.97 123.51,34.61 110.24,34.61 v109.98,34.35
  Bottom 0.305: v109.98,42.55 v109.98,34.35 | v146.94,24.26 v146.94,21.78
AUX_IN  (via drill 0.4)
  Top 0.254: 17.91,70.48 C72.2 | 76.14,32.99 IC17.1 76.07,33.06 v76.07,34.8 | v14.8,61.21 ZD5.3 | v61.66,50.8 61.98,50.48 73.91,50.48 v74.11,50.29
  Top 0.406: C72.2 17.79,70.48 14.86,70.48 | 14.86,70.48 R82.1 | ZD5.3 14.86,70.27 14.86,70.48
  Bottom 0.254: v14.8,61.21 17.97,61.21 19.11,60.07 37.34,60.07 42.16,55.24 42.16,52.2 44.64,49.72 59.56,49.72 60.64,50.8 v61.66,50.8 | v76.07,34.8 76.07,48.32 v74.11,50.29
AUX_USET_SW  (via drill 0.4)
  Top 0.254: 78.04,35.69 124.4,35.69 v124.71,35.37 | IC17.6 78.03,35.67 78.04,35.69 | 78.04,35.69 v64.96,35.69 | IC14.4 141.48,51.63 140.46,52.64 129.48,52.64 125.03,48.2 v125.03,43.5 | v9.84,47.31 35.31,47.31 39.24,43.37 v43.5,43.37
  Bottom 0.254: v64.96,35.69 45.4,35.69 43.18,37.91 43.18,43.05 v43.5,43.37 | v9.84,47.31 8.45,47.31 4.7,51.05 4.7,67.5 5.71,68.52 5.71,71.52 LED1.TA | v124.71,35.37 124.71,43.18 v125.03,43.5
CC_ACTIVE  (via drill 0.4)
  Top 0.254: R105.2 R103.1 | 92.58,52.07 92.58,52.14 93.47,53.02 93.47,54.74 95.5,56.77 Q20.1 v97.03,57.28 | 143.45,56.83 IC14.22 143.43,55.74 142.75,55.05 119.63,55.05 v119.51,54.93
  Top 0.305: R103.1 92.58,52.07
  Bottom 0.254: v119.51,54.93 119.44,54.99 99.69,54.99 97.41,57.28 v97.03,57.28
CC_LED
  Top 0.254: R98.2 10.16,79.95 8.76,78.55 5.75,78.55 LED3.BC
CS_ADC  (via drill 0.4)
  Top 0.254: IC18.2 119.19,30.16 119.83,30.8 v120.21,30.8 | RN1.7 125.09,29.79 v124.08,30.8
  Bottom 0.254: v124.08,30.8 v120.21,30.8
CS_DAC  (via drill 0.4)
  Top 0.254: IC16.5 97.99,25.58 v98.23,25.34 | v122.49,23.18 122.49,24.55 RN1.8
  Bottom 0.254: v98.23,25.34 98.49,25.08 98.49,19.18 99.95,17.72 103.06,17.72 104.39,16.38 115.76,16.38 v122.49,23.18
CS_IOEXP  (via drill 0.4)
  Top 0.254: IC14.11 146.05,45.4 145.03,44.39 v144.21,44.39 | v139.57,33.53 139.26,33.85 128.97,33.85 125.99,30.87 RN1.6
  Bottom 0.254: v139.57,33.53 140.08,34.04 140.08,42.74 141.73,44.39 v144.21,44.39
CSA
  Top 0.254: IC5.1 126.36,17.22 126.36,16.7 119.63,16.7 117.54,14.61 IC4.13
CSB
  Top 0.254: IC4.12 118.81,14.61 119.19,14.99 120.4,16.19 126.62,16.19 126.88,16.45 IC5.2
CURR_5A  (via drill 0.4)
  Top 0.254: 61.85,75.77 Q14.4 61.53,76.06 v61.53,76.45 | R72.2 v52.9,83.25 53.21,83.57 53.21,87.95 57.66,92.39 121.22,92.39 128.52,85.09 v128.91,85.09 | IC14.28 139.55,58.01 139.83,58.29 139.83,74.3 v138.24,75.88
  Bottom 0.254: v52.9,83.25 54.74,83.25 v61.53,76.45 | v138.24,75.88 137.41,76.71 137.29,76.71 v128.91,85.09
CURR_50MA  (via drill 0.4)
  Top 0.254: Q12.4 60.31,88.71 v55.18,88.71 | R61.2 51.94,87.7 v51.94,88.71 52.32,88.71 57.15,93.53 121.6,93.53 128.78,86.36 129.92,86.36 v130.05,86.23 | IC14.26 140.84,75.56 v139.38,77.03 139.57,76.83
  Bottom 0.254: v55.18,88.71 v51.94,88.71 | v139.38,77.03 139.32,77.03 138.56,77.79 137.73,77.79 130.87,84.64 130.87,85.41 v130.05,86.23
CURR_500MA  (via drill 0.4)
  Top 0.254: R69.2 v52.39,85.22 52.64,85.47 52.64,88.2 57.4,92.96 121.41,92.96 128.52,85.85 129.29,85.85 v130.05,85.09 | v61.53,82.17 61.53,81.77 Q13.4 | IC14.27 140.18,57.89 140.34,58.04 140.34,74.93 138.3,76.96 v138.24,76.96
  Bottom 0.254: v61.53,82.17 58.48,85.22 v52.39,85.22 | v138.24,76.96 138.24,77.03 137.99,77.28 137.48,77.28 130.05,84.71 v130.05,85.09
CV_ACTIVE  (via drill 0.4)
  Top 0.254: R92.2 R90.1 93.09,58.42 v93.73,59.05 | v95.38,60.26 Q19.1 | IC14.23 142.8,55.93 142.49,55.63 120.02,55.63 119.63,56.01 v119.06,56.01
  Bottom 0.254: v119.06,56.01 118.94,56.01 118.43,55.5 99.95,55.5 97.41,58.04 94.74,58.04 v93.73,59.05 94.93,60.26 v95.38,60.26
CV_LED
  Top 0.254: R94.1 9.84,77.98 9.1,77.23 LED3.TC
DC+
  Top 0.61: C1.2 182.63,21.73 L1.1
  Top 0.813: X1.1 169.54,9.08 169.36,8.9 168.53,8.07 R1.2
  Bottom 2.54: L1.1 176.1,18.62 171.07,13.59 X1.1
DC-
  Top 0.61: C1.1 182.63,25.52 L1.3
  Top 0.813: X1.2 162.94,7.97 R1.1
  Bottom 2.54: L1.3 179.52,26.87 165.57,12.91 X1.2
DC_OUT  (via drill 0.4)
  Top 0.254: C8.2 169.84,47.15 169.84,47.22 170.12,47.5 170.12,49.66 171.07,50.61 R3.1 | IC1.11 169.84,44.04 169.67,43.85 167.07,43.85 C7.1
  Top 0.305: C8.2 169.8,47.18
  Top 0.356: IC1.11 169.84,47.15
  Top 0.406: 90.81,77.22 R35.2 | R36.2 89.54,81.28 90.49,81.28 90.81,80.96 90.81,77.22 | C4.2 160.02,19.88 159.32,20.57 159.32,23.05 158.69,23.69 157.35,23.69 | ZD1.C v161.29,42.48 | C20.+ 157.35,23.69 | 90.81,77.22 90.81,76.58 92.77,74.61 105.98,74.61 108.78,77.41 111.32,77.41 112.52,78.61 112.52,80.64 112.46,80.71 | 157.35,23.69 152.72,23.69 150.94,25.46 IC2.3
  Top 0.61: C4.2 163.27,19.87 L1.2 | ZD1.C 160.92,44.13 153.03,44.13 v151.13,46.04 | v144.91,87.76 134.37,87.76 127.76,81.15 116.97,81.15 C40.1 117.28,82.05 113.44,82.05 Q5.4
  Bottom 0.61: v144.91,87.76 144.91,83 145.8,82.11 149.54,82.11 150.69,80.96 150.69,46.48 v151.13,46.04
  Bottom 2.54: L1.2 160.84,22.3 160.84,41.78 162.5,43.43
  other vias: 176.34,47.43 174.82,47.43 175.58,48.51 174.82,48.51 174.82,49.59 175.58,49.59 176.34,49.59 175.58,47.43 176.34,48.51 162.05,42.48 160.53,42.48
  pour Top (isolate 0.305, no thermals): 167.45,56.01 179.01,56.01 179.96,55.05 179.96,48.13 179.32,47.5 178.82,47.05 174.43,47.05 174.43,48.77 173.99,49.15 173.67,49.15 173.67,53.21 173.35,53.53 167.96,53.53 167.45,54.04
  pour Bottom (isolate 0.406, no thermals): 161.04,48.13 171.83,48.13 173.74,50.04 177.29,50.04 177.29,46.48 175.58,44.77 165.42,44.77 162.56,41.91 160.15,41.91 160.15,47.24
  pour Top (isolate 0.305): 107.76,89.22 115.57,89.22 116.52,88.27 116.52,81.28 115.57,80.33 106.81,80.33 106.81,88.27
DIB_5V  (1 unrouted)
DIB_12V  (1 unrouted)
DIB_A0  (via drill 0.4)  (1 unrouted)
  Top 0.203: R26.2 104.52,4.45 v104.78,4.19 104.9,4.06 107.06,4.06 107.7,4.7 107.7,5.61 IC9.7 | IC8.1 97.78,4.32 v97.92,4.19
  Top 0.254: IC8.1 95.75,4.32 v93.22,6.86
  Bottom 0.203: v104.78,4.19 101.47,4.19 100.97,3.68 100.46,3.68 99.95,4.19 v97.92,4.19
  Bottom 0.254: 74.84,9.55 76.77,7.62 90.23,7.62 90.74,7.11 92.96,7.11 v93.22,6.86
DIB_A1  (via drill 0.4)
  Top 0.203: IC8.2 98.55,5.59 98.74,5.4 100.71,5.4 R25.2 101.66,6.73 102.3,7.37 104.84,7.37 105.73,6.48 105.73,4.83 106.05,4.51 106.81,4.51 107.05,4.75 IC9.6
  Top 0.254: IC8.2 95.69,5.59 v94.3,6.99
  Bottom 0.254: v94.3,6.99 93.66,7.62 90.93,7.62 90.42,8.13 79.21,8.13 X2.19
DIB_A2  (via drill 0.4)
  Top 0.203: IC9.5 106.41,6.43 105.03,7.81 101.16,7.81 R24.2
  Top 0.254: R24.2 99.69,6.86 IC8.3 95.56,6.86 94.42,8 v94.42,8.06 | v88.77,10.54 88.08,11.24 76.1,11.24 X2.18
  Bottom 0.254: v88.77,10.54 91.19,8.13 94.36,8.13 v94.42,8.06
DIB_CSA  (via drill 0.4)
  Top 0.254: v117.54,7.37 IC4.4 | v117.54,4.13 116.84,3.43 67.18,3.43 v64.33,6.29
  Bottom 0.254: v117.54,4.13 v117.54,7.37 | v64.33,6.29 64.33,9.61 X2.9
DIB_CSB  (via drill 0.4)  (1 unrouted)
  Top 0.203: IC4.5 v118.81,9.53
  Top 0.254: 67.17,12.5 65.98,11.3 65.98,9.14 66.48,8.64 68.45,8.64 70.29,6.79 71.06,6.79 71.56,7.3 87.25,7.3 88.08,8.13 89.79,8.13 91.44,9.78 96.33,9.78 v97.03,10.48
  Bottom 0.254: v118.81,9.53 116.33,9.53 115.76,10.1 110.62,10.1 109.86,9.34 108.65,9.34 108.39,9.59 97.92,9.59 v97.03,10.48
DIB_IRQ  (via drill 0.4)  (1 unrouted)
  Top 0.254: v133.92,6.48 IC7.6 | v127.89,6.35 127.89,6.1 v111.44,6.1 | v73.28,5.33 75.75,5.33 v75.82,5.27
  Bottom 0.254: v133.92,6.48 133.54,6.1 128.08,6.1 v127.89,6.35 | 64.72,12.5 65.98,11.24 65.98,6.16 66.8,5.33 v73.28,5.33 | v111.44,6.1 110.49,5.14 106.81,5.14 105.79,6.16 97.03,6.16 95.82,4.95 89.15,4.95 88.58,5.52 87.5,5.52 86.87,4.89 76.2,4.89 v75.82,5.27
DIB_MISO  (via drill 0.4)  (1 unrouted)
  Top 0.254: 69.71,12.5 68.52,11.3 68.52,9.27 69.47,8.32 86.81,8.32 87.69,9.21 89.34,9.21 90.93,10.79 94.68,10.79 v94.93,11.05 | v116.65,10.29 119.19,10.29 120.08,9.4 IC4.6
  Bottom 0.254: v116.65,10.29 116.33,10.6 110.36,10.6 109.6,9.84 108.84,9.84 108.58,10.1 98.55,10.1 97.35,11.3 95.25,11.3 v94.93,11.05
DIB_MOSI  (via drill 0.4)
  Top 0.254: IC7.3 130.11,6.79 128.91,5.59 112.01,5.59 v111.44,5.02
  Bottom 0.254: v111.44,5.02 111.06,4.64 106.55,4.64 105.54,5.65 97.22,5.65 96.01,4.45 88.96,4.45 88.39,5.02 87.76,5.02 87.12,4.38 75.44,4.38 72.3,7.52 X2.15
DIB_NFAULT  (via drill 0.4)
  Top 0.254: v60.2,7.11 67.31,7.11 v67.63,6.79 | IC9.3 107.05,8.84 v107.06,8.83 | v70.67,7.56 70.93,7.81 87,7.81 87.82,8.64 89.53,8.64 91.19,10.29 95.69,10.29 v95.95,10.54
  Bottom 0.254: v60.2,7.11 59.91,7.11 X2.3 | 67.88,7.05 v67.63,6.79 68.39,7.56 v70.67,7.56 | v95.95,10.54 95.95,10.41 97.28,9.08 106.81,9.08 v107.06,8.83
DIB_NRESET
  Top 0.254: IC7.5 132.65,7.68 127.32,2.35 62.29,2.35 55.82,8.83 55.82,11.26 X2.4
DIB_SCL
  Top 0.203: 107.82,9.78 107.71,9.89 IC9.2 107.7,10.01 107.7,10.79 107.44,11.05 106.05,11.05 103.82,8.83 93.98,8.83 92.02,6.86 IC8.6
  Top 0.254: IC8.6 91.22,7.05 88.46,7.05 87.69,6.29 72.01,6.29 71.5,5.78 69.79,5.78 67.94,7.62 61.94,7.62 X2.5
DIB_SCLK  (via drill 0.4)
  Top 0.254: IC4.3 116.27,9.59 115.44,10.41 109.41,10.41 v109.22,10.6 | v94.17,11.81 93.66,11.3 90.68,11.3 89.09,9.72 87.44,9.72 86.55,8.83 71.37,8.83 70.24,9.96 X2.13
  Bottom 0.254: v109.22,10.6 98.74,10.6 97.54,11.81 v94.17,11.81
DIB_SDA  (1 unrouted)
  Top 0.203: IC9.1 108.34,10.91 107.76,11.49 105.86,11.49 103.63,9.27 93.79,9.27 92.65,8.13 IC8.5
  Top 0.254: IC8.5 91.35,8.19 90.81,8.19 90.23,7.62 88.33,7.62 87.5,6.79 71.82,6.79 71.31,6.29 70.04,6.29 68.2,8.13 64.39,8.13 63.37,9.14 63.37,11.3 62.18,12.5
DP_LED  (via drill 0.4)
  Top 0.254: v107.25,34.35 107.25,33.92 Q16.3 | v108.9,42.99 108.33,42.99 R79.2
  Bottom 0.254: v108.9,42.99 108.9,36.01 v107.25,34.35
DP_S  (1 unrouted)
  Top 0.305: R32.1 R31.1 108.01,54.17 108.39,54.55 | 108.33,54.05 R29.1
  Top 1.27: 107.87,58.64 R28.1 107.96,58.62 | R29.1 108.39,54.55 110.74,54.55 114.47,50.82 114.47,49.61
  pour Top (isolate 0.305): 108.84,60.01 104.14,60.01 104.14,53.02 108.84,53.02
FB  (via drill 0.4)
  Top 0.254: 171.51,36.89 R14.1 171.79,37.43 171.79,38.1 | 171.79,38.1 IC1.5 | v172.09,38.16 171.86,38.16 171.79,38.1 | v177.67,37.85 R12.2 177.67,35.52 Q2.C 181.23,35.43 C19.1
  Bottom 0.254: v172.09,38.16 177.36,38.16 v177.67,37.85
GCOM  (via drill 0.4)
  Top 0.406: R40.1 70.93,26.74 v71.44,26.23 | IC11.7 IC11.6 81.85,24.9 81.22,25.53 v81.22,26.23 | R59.1 66.74,82.74 v66.74,81.47
  Bottom 0.406: v81.22,26.23 v71.44,26.23 71.44,32.07 69.22,34.29 69.22,52.64 66.74,55.12 v66.74,81.47
GND  (via drill 0.4)  (2 unrouted)
  Top 0.254: C57.1 v75.25,28 | C79.1 v114.43,27.43 | C77.1 v113.92,20.64 | v113.35,18.8 C78.1 | C70.1 v108.78,26.67 | C69.1 v108.78,22.73 | C74.1 v108.78,18.8 | C73.2 v108.78,30.61 | IC18.8 115.29,28.35 115.7,27.94 117,27.94 117.24,28.18 IC18.5 | 117.86,29.18 IC18.4 | IC18.3 IC18.4 | IC18.5 IC18.4 | IC18.5 117.24,30.18 v117.47,30.42 | Q26.2 29.08,53.78 | v24.83,73.98 23.96,73.98 Q24.E | v24.96,71.75 R118.1 | v18.8,72.64 C72.1 | IC13.4 97.74,88.82 v97.73,88.84 | v101.22,88.84 101.19,88.01 C62.1 | C51.1 v65.22,19.94 | v65.72,39.12 C85.1 | v115,14.8 IC4.15 | IC7.9 136.49,13.72 136.49,14.83 v136.4,14.92 | v122.68,14.86 122.66,13.78 IC4.9 | Q22.E 29,75.75 v29.78,75.75 | R109.1 v26.04,73.79 | v96.27,24.45 96.27,23.58 C68.1 | C76.1 v119.13,18.35 | C75.1 v120.71,18.99 | v97.28,27.94 97.28,27.56 IC16.8 | C42.2 v97.54,83.44 | IC6.2 153.96,15.34 153.99,15.37 153.99,16.32 v154.24,16.57 | v152.21,13.53 IC6.17 | 153.48,10.79 153.48,9.46 v153.99,8.95 | R21.2 v158.43,7.94 | v150.18,5.97 149.41,5.97 C26.2 | C27.- v155.89,4 | v147.57,9.21 146.3,9.14 C28.2 | v150.18,20.07 149.41,20.07 C33.1 | v147.57,16.64 146.81,16.64 C32.2 | R22.1 v158.56,16.89 C31.1 | C34.+ 157.8,21.91 v158.18,22.29 | IC3.4 v151.45,35.12 | IC5.4 128.29,17.23 v128.4,17.27 | v63.69,88.08 C49.1 | v64.26,86.11 C50.2 | C53.1 v63.69,90.04 | IC20.4 v71.94,39.68 v71.94,39.69 | C83.1 v65.72,46.99 | R93.2 v65.72,43.05 | R69.1 v48.51,85.22 | R72.1 v48.51,83.25 | R61.1 v48.51,87.19 | v88.2,60.58 C80.1 | R102.2 v75.44,54.42 | R97.1 v75.44,56.39 | v79.76,41.53 Q21.2 | C84.1 v88.2,50.86 | IC17.2 v74.99,32.32 | Q19.2 v96.97,61.66 | v95.89,58.86 96.97,58.86 Q20.2 | v156.46,13.91 C29.1 | IC14.10 145.39,51.03 v145.22,51.18 | 147.07,36.06 C22.-
  Top 0.254: Q15.2 v91.69,89.66 91.69,90.55 R75.1
  Top 0.305: ZD5.1 v15.74,73.47 v15.75,73.47 | ZD5.2 13.85,73.41 v13.91,73.47 | v14.41,76.01 13.46,76.01 R77.1 | R43.1 v92.46,80.01 | R44.1 v92.46,78.04 | C52.1 v82.04,19.81 | C58.1 v85.79,27.88 | v85.6,29.72 R33.2 84.96,29.47 84.96,27.98 C39.2 | v50.86,44.64 R100.1 | 51.75,44.33 R101.1 v52.9,44.58 | v92.46,81.98 R47.1 | v80.64,30.86 79.86,30.86 C71.2 | 78.93,84.84 78.87,84.77 | v154.88,31.43 R16.2 | v157.04,28.45 157.04,29.7 C20.- | IC14.15 IC14.16 | IC14.16 IC14.17 | v147.32,58.42 147.32,56.87 IC14.16 | v12.51,37.15 R78.2
  Top 0.406: 29.08,53.78 R121.1 | v26.92,54.67 26.92,53.82 Q26.2 | v128.97,14.86 IC7.15 | v124.4,14.61 124.4,13.8 C36.1 | C63.2 v95.06,32.32 | C65.1 v93.22,31.75 | IC15.4 v101.98,22.42 | C66.- 102.11,24.51 v101.92,24.13 | C64.2 106.43,21.21 v106.11,20.89 | C67.2 v95.19,18.86 | C24.1 v109.6,13.72 | D14.C v43.43,46.55 | v79.88,84.84 78.91,84.84 C55.1 | v79.31,88.71 C56.2 | C54.1 v79.88,86.74 | C21.2 v157.42,36.07 | R19.2 v155.7,40.01 | ZD2.A v142.05,3.05 | v116.59,79.88 116.59,79.12 C40.2 | C81.2 v74.04,47.18 | C82.1 v73.41,45.34 | C61.2 v144.15,45.97 | v124.21,18.67 125.01,18.67 C25.2
  Top 0.813: v86.11,31.75 v89.72,31.75 v91.5,31.75 v93.22,31.75 | v66.74,31.11 v69.47,31.11 v72.33,31.11 | v64.39,28.19 v66.04,28.19 | v68.33,51.37 v70.55,51.37 v72.64,51.37 | v84.01,42.55 v86.49,42.55 | v90.68,44.9 v92.84,44.9 | v113.35,15.56 v113.35,18.8 | v65.85,70.99 v69.28,70.99 | v108.78,15.56 v108.78,18.8 | v139.26,35.62 147.07,35.62 147.13,35.56 C22.- | v93.73,73.66 v95.38,73.66 | v90.68,60.07 v92.84,60.07 | v90.68,50.42 v92.84,50.42 | v65.85,59.63 v67.63,59.63 v69.28,59.63 | v104.08,73.66 v102.42,73.66 v99.31,73.66
  Bottom 0.305: 14.1,55.18 12.51,53.59 v12.51,37.15
  Bottom 3.81: SH1.2 149.03,92.01
  other vias: 117.35,79.88 106.87,20.89 101.92,24.89 100.77,19.56 153.23,12.51 153.23,13.53 152.21,12.51 147.57,17.4 147.76,36.7 158.18,21.53 150.18,20.83 150.18,5.21 147.57,8.45 157.8,28.45 155.89,4.76 87.95,31.75 147,36.7
  pour Top: 96.52,23.11 105.16,23.11 105.16,18.29 96.52,18.29
  pour Bottom (isolate 0.254, rank 2): 13.97,84.52 21.78,84.52 32.26,95 150.88,95 150.88,88.46 150.11,87.76 144.78,87.76 144.78,83.06 145.73,82.11 150.24,82.11 150.69,81.66 150.69,49.66 152.21,48.13 157.99,48.13 158.88,47.24 158.88,1.97 158.12,1.21 138.94,1.21 138.18,1.97 138.18,11.3 137.29,12.19 105.73,12.19 104.97,12.95 104.97,15.81 103.06,17.72 99.06,17.72 96.58,15.24 57.15,15.24 56.2,16.19 56.2,35.62 57.09,36.51 61.91,36.51 62.8,37.4 62.8,41.91 61.91,42.8 42.42,42.8 41.78,43.43 41.78,49.91 42.29,50.42 51.5,50.42 53.15,52.07 53.15,58.29 54.48,59.63 61.02,59.63 61.91,60.52 61.91,69.79 52.07,79.95 40.45,79.95 32.26,71.75 32.26,55.37 31.24,54.36 14.29,54.36 13.21,55.44 13.21,60.2 12.95,60.45 7.18,60.45 6.86,60.77 6.86,63.18 7.18,63.5 12.95,63.5 13.21,63.75 13.21,83.76
GNDIO  (via drill 0.4)
  Top 0.254: IC7.2 v128.84,7.18 | v126.81,6.99 C35.2 | 89,6.29 C37.1 89.43,5.71 89.92,5.71 | v106.05,8.26 106.05,8.95 106.43,9.34 106.43,9.98 IC9.4 | IC8.7 91.41,5.62 91.5,5.71 89.92,5.71 | v89.92,6.16 89.92,5.71 | C23.2 110.47,8.66 v110.49,8.64
  Top 0.305: v109.22,7.3 110.08,7.3 C38.2
  Top 0.406: IC7.8 v136.46,7.18 | IC4.8 v123.25,8.38 | IC4.2 v115,9.27
  other vias: 95.69,8.06 53.78,3.68 63.31,4.83 57.4,8.45
  pour Bottom (isolate 0.254): 53.85,13.72 53.09,12.95 53.09,3.68 53.85,2.92 135.95,2.92 136.72,3.68 136.72,9.91 135.95,10.67 98.93,10.67 97.16,12.45 97.16,13.27 96.71,13.72
  pour Top (isolate 0.254): 53.85,13.72 53.09,12.95 53.09,3.68 53.85,2.92 97.16,2.92 97.16,13.27 96.71,13.72
HOLE_DL  (via drill 3.2 pad 5.5)
  other vias: 11,5.5
HOLE_DL2  (via drill 3.2 pad 5.5)
  other vias: 101,14
HOLE_DL3  (via drill 3.2 pad 5.5)
  other vias: 141,14
HOLE_UL  (via drill 3.2 pad 5.5)
  other vias: 11,89.5
HOLE_UL2  (via drill 3.2 pad 5.5)
  other vias: 121,85
I_MON  (via drill 0.4)
  Top 0.254: IC12.6 v70.1,87.32 v70.1,87.31 | v82.8,34.1 82.87,34.16 98.81,34.16 100.01,32.96 100.39,32.58 101.73,31.24 106.62,31.24 107.38,32 109.79,32 109.79,32.01 R85.1 | v81.53,44.45 R64.1 81.54,45.78 81.47,45.85 80.39,45.85 68.45,57.78 v68.45,58.42 | v70.11,87.32 v70.1,87.31 | R68.2 70.81,88.01 v70.1,87.31
  Bottom 0.254: v70.1,87.31 70.1,80.01 68.45,78.36 v68.45,58.42 | v82.8,34.1 82.8,34.54 81.53,35.81 v81.53,44.45
I_SERVO  (via drill 0.4)
  Top 0.254: C59.2 | v94.87,42.61 94.87,47.31 | 94.87,47.31 94.87,49.88 D10.C | R106.1 v93.47,47.31 | v95.19,47.31 94.87,47.31
  Top 0.305: C59.2 D12.A 88.8,22.04 | 88.8,22.04 88.8,22.25 88.9,22.35 IC11.1 | v92.39,21.97 88.87,21.97 88.8,22.04
  Bottom 0.254: v92.39,21.97 92.39,33.85 94.87,36.32 v94.87,42.61 | v93.47,47.31 v95.19,47.31
I_SET  (via drill 0.4)
  Top 0.254: IC16.4 94.09,25.58 v94.11,25.59 | R80.1 109.22,25.27 104.97,25.27 101.47,28.77 96.58,28.77 95.12,27.3 v95.12,27.24
  Top 0.305: IC16.4 92.76,23.32 R63.1
  Bottom 0.254: v94.11,25.59 94.11,26.23 v95.12,27.24
IRQ  (via drill 0.4)
  Top 0.254: IC14.20 144.73,54.09 v145.8,53.02 | v141.22,29.4 140.91,29.08 140.91,25.4 135.09,19.58 RN2.5
  Bottom 0.254: v145.8,53.02 146.05,52.77 146.05,44.9 142.11,40.96 142.11,30.35 141.22,29.46 v141.22,29.4
ISENSE+  (1 unrouted)
  Top 0.254: IC12.3 73.41,87.32 71.37,85.28 71.37,82.87 71.25,82.74 70.87,82.74 R60.2 | R59.2 70.61,82.87 R60.2
ISENSE-  (via drill 0.4)
  Top 0.254: 72.65,82.67 R73.2 72.52,82.67 72.52,82.68 72.52,85.53 73.03,86.04 v73.28,86.04 v73.28,86.05 IC12.2 | R68.1 72.7,88.27 v72.9,88.08
  Bottom 0.254: v73.28,86.04 73.28,87.69 v72.9,88.08
KNOCKOUT
  cutout Bottom: 109.28,72.26 109.79,72.77 115.63,72.77 116.2,72.26 116.2,57.78 115.7,57.28 109.79,57.28 109.28,57.78
  cutout Bottom: 112.33,42.86 111.82,43.37 111.82,50.61 112.33,51.12 116.59,51.12 117.09,50.61 117.09,43.37 116.59,42.86
L_OUT
  Top 0.254: R10.1 R9.1 | R9.1 179.96,46.35 180.91,47.31 180.91,64.45 176.66,68.71 | R9.1 179.13,42.35 R12.1
  Top 0.61: L3.1 180.64,83.3 182.05,84.71 R6.1
  pour Top (isolate 0.406, no thermals): 154.69,72.14 154.69,81.22 156.02,82.55 173.8,82.55 175.64,84.39 179.01,84.39 179.01,79.25 177.23,77.47 177.23,69.02 176.34,68.14 168.53,68.14 165.67,70.99 155.89,70.99
LOOP_CTRL  (via drill 0.4)
  Top 0.305: D8.A D10.A 96.27,54.74 96.58,55.05 97.79,55.05 98.49,55.75 v98.49,62.48 | R50.1 102.17,76.97 v101.6,76.39
  Bottom 0.305: v101.6,76.39 101.6,65.6 v98.49,62.48
MISO  (via drill 0.4)
  Top 0.254: IC18.15 119.19,22.67 119.44,22.42 121.28,22.42 122.11,21.59 v125.67,21.59 | IC14.14 147.98,45.05 144.84,41.91 v141.92,41.91 | v141.29,30.67 140.4,29.78 140.4,25.65 136.08,21.34 131.51,21.34 130.8,20.63 130.8,20.45 | 130.81,19.41 RN2.7 130.8,20.45 | 130.8,20.45 v130.75,20.51
  Bottom 0.254: v141.29,30.67 141.6,30.99 141.6,41.59 v141.92,41.91 | v125.67,21.59 126.05,21.59 126.49,21.14 130.11,21.14 v130.75,20.51
MOSI  (via drill 0.4)
  Top 0.254: IC16.7 98.69,26.87 v98.93,27.11 | 131.7,19.41 RN2.6 131.7,20.39 v131.83,20.51 | IC18.16 119.84,23.94 120.59,23.94 v120.71,23.81 122.17,22.35 v124.9,22.35 | IC14.13 147.34,45.17 144.91,42.74 v142.75,42.74 | v140.84,31.75 139.89,30.8 139.89,25.91 135.83,21.84 130.94,21.84 v130.81,21.72
  Bottom 0.254: v98.93,27.11 99,27.05 99,19.43 100.2,18.22 103.31,18.22 104.65,16.89 115.51,16.89 120.4,21.78 120.4,23.5 v120.71,23.81 | v140.84,31.75 141.1,32 141.1,42.23 141.6,42.74 v142.75,42.74 | v124.9,22.35 126.05,22.35 126.75,21.65 130.75,21.65 v130.81,21.72 130.81,21.53 v131.83,20.51
N$1
  Top 0.254: Q2.E 179.79,37.99 D3.C 179.55,40.17 R9.2
N$2
  Top 0.254: R11.1 C18.1
N$3
  Top 0.305: LED4.A R107.2
N$4
  Top 0.254: IC5.5 127.88,22.17 125.99,24.06 RN1.3
N$6
  Top 0.254: IC5.7 126.88,21.52 124.19,24.21 RN1.1
N$7
  Top 0.254: IC1.8 171.79,45.56 172.15,45.91 174.15,45.91 D1.C 175.86,46 R2.2
N$8
  Top 0.254: C17.1 173.29,36.96 173.29,38.8 172.47,39.62 172.47,40.35 IC1.6 175.19,40.37 R11.2
N$9
  Top 0.254: IC4.11 120.08,14.48 121.28,15.68 129.41,15.68 130.81,17.08 RN2.2 130.8,17.84
N$10  (via drill 0.4)
  Top 0.254: v133.92,15.05 IC7.11 | RN2.4 133.06,17.88 v133.22,17.72
  Bottom 0.254: v133.92,15.05 133.92,17.02 v133.22,17.72
N$11
  Top 0.61: R65.1 74.23,77.79 74.74,77.28 74.74,72.14 74.42,71.82 R71.2S
N$12
  Top 0.254: R78.1 12.51,30.35 11.56,29.4 9.54,29.4 LED2.CC
N$13  (via drill 0.4)
  Top 0.254: IC20.7 77.47,42.22 | R95.2 47.88,45.02 v46.8,45.02 | 77.47,42.22 77.47,45.21 74.3,48.39 62.17,48.39 61.98,48.2 v60.83,48.2 | 77.47,42.22 78.3,42.22 78.36,42.16 Q21.1
  Bottom 0.254: v60.83,48.2 49.97,48.2 v46.8,45.02
N$14
  Top 0.254: R56.2 C46.1
N$15
  Top 1.778: Q17.A2 44.58,55.69 42.42,57.85 36.2,57.85 33.78,55.44 R96.2
N$17
  Top 0.406: R82.2 R83.1
N$18
  Top 0.508: R89.1 50.21,50.67 Q18.C
  Top 0.61: Q18.C 50.35,53.85 Q17.G
N$19
  Top 0.406: R101.2 51.82,48.11 Q18.E
N$20